# Altium schematic sheet 海关全向控制器电池接口板V4.SchDoc
size A4
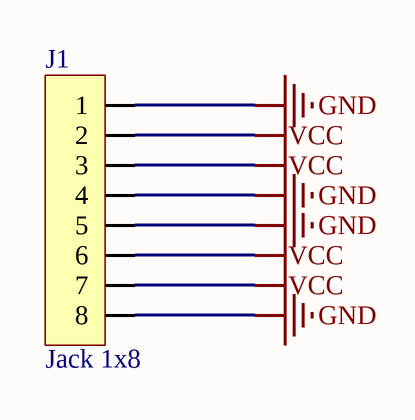
[diagram p0: 海关全向控制器电池接口板V4.SchDoc]

## Parts
J1  Jack 1x8  [Pow-8P-F]

## Nets
GND: J1.1 J1.4 J1.5 J1.8
VCC: J1.2 J1.3 J1.6 J1.7

## Notes on the sheet
- 文件名:
- 审核:
- 制图人:
- 孟浩
- 校对:
- 图号:
- 批准:
- 日期:

## Library data of the parts
J1 = Jack 1x8: 插座